# Altium project SO020100000.PrjPcb
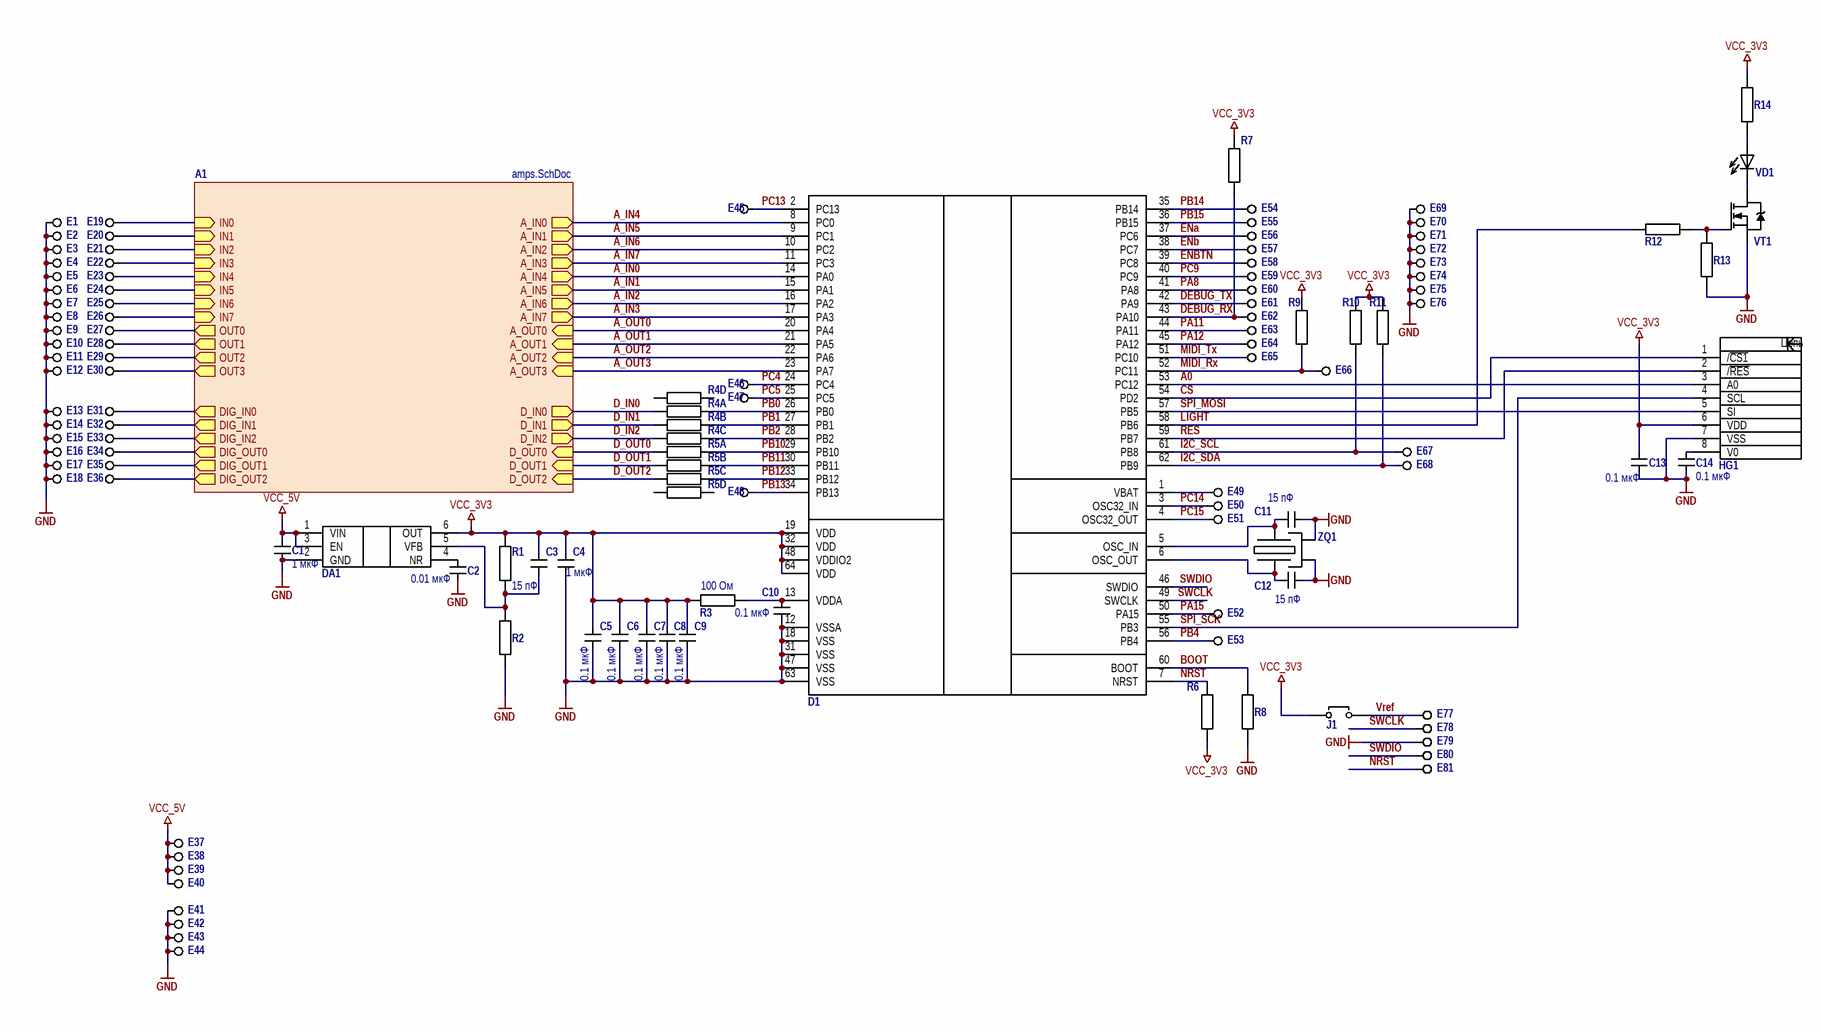
[diagram p0: main.SchDoc]
Revision: 0
2 sheets, 192 parts. Net scope: hierarchical (ports join the sheet entries above them; power ports are global).
Board file: SO020100001_001.PcbDoc
Sheets:
  main.SchDoc
    A1 = amps.SchDoc

## Sheet main.SchDoc
size 420 x 297 mm; DocumentNumber: 1; SheetNumber: 1; SheetTotal: 2

### Parts
C1  value 1 мкФ  [CAPC1608X08L]  (hidden comment: C0603_16v_1u)
C2  value 0.01 мкФ  [CAPC1608X08L]  (hidden comment: C0603_50v_0,01u)
C3  value 15 пФ  [CAPC1608X08L]  (hidden comment: C0603_50v_15p)
C4  value 1 мкФ  [CAPC1608X08L]  (hidden comment: C0603_16v_1u)
C5  value 0.1 мкФ  [CAPC1608X08L]  (hidden comment: C0603_50v_0,1u)
C6  value 0.1 мкФ  [CAPC1608X08L]  (hidden comment: C0603_50v_0,1u)
C7  value 0.1 мкФ  [CAPC1608X08L]  (hidden comment: C0603_50v_0,1u)
C8  value 0.1 мкФ  [CAPC1608X08L]  (hidden comment: C0603_50v_0,1u)
C9  value 0.1 мкФ  [CAPC1608X08L]  (hidden comment: C0603_50v_0,1u)
C10  value 0.1 мкФ  [CAPC1608X08L]  (hidden comment: C0603_50v_0,1u)
C11  value 15 пФ  [CAPC1608X08L]  (hidden comment: C0603_50v_15p)
C12  value 15 пФ  [CAPC1608X08L]  (hidden comment: C0603_50v_15p)
C13  value 0.1 мкФ  [CAPC1608X08L]  (hidden comment: C0603_50v_0,1u)
C14  value 0.1 мкФ  [CAPC1608X08L]  (hidden comment: C0603_50v_0,1u)
D1  STM32F091RB6  [TSQFP50P_10x10_64N]  (value not drawn)
DA1  TPS73001DBVT  [SOT95P280X145-6N]  (value not drawn)
E1  CON 0.9mm  [con_0.9mm]  (value not drawn)  (no BOM)
E2  CON 0.9mm  [con_0.9mm]  (value not drawn)  (no BOM)
E3  CON 0.9mm  [con_0.9mm]  (value not drawn)  (no BOM)
E4  CON 0.9mm  [con_0.9mm]  (value not drawn)  (no BOM)
E5  CON 0.9mm  [con_0.9mm]  (value not drawn)  (no BOM)
E6  CON 0.9mm  [con_0.9mm]  (value not drawn)  (no BOM)
E7  CON 0.9mm  [con_0.9mm]  (value not drawn)  (no BOM)
E8  CON 0.9mm  [con_0.9mm]  (value not drawn)  (no BOM)
E9  CON 0.9mm  [con_0.9mm]  (value not drawn)  (no BOM)
E10  CON 0.9mm  [con_0.9mm]  (value not drawn)  (no BOM)
E11  CON 0.9mm  [con_0.9mm]  (value not drawn)  (no BOM)
E12  CON 0.9mm  [con_0.9mm]  (value not drawn)  (no BOM)
E13  CON 0.9mm  [con_0.9mm]  (value not drawn)  (no BOM)
E14  CON 0.9mm  [con_0.9mm]  (value not drawn)  (no BOM)
E15  CON 0.9mm  [con_0.9mm]  (value not drawn)  (no BOM)
E16  CON 0.9mm  [con_0.9mm]  (value not drawn)  (no BOM)
E17  CON 0.9mm  [con_0.9mm]  (value not drawn)  (no BOM)
E18  CON 0.9mm  [con_0.9mm]  (value not drawn)  (no BOM)
E19  CON 0.9mm  [con_0.9mm]  (value not drawn)  (no BOM)
E20  CON 0.9mm  [con_0.9mm]  (value not drawn)  (no BOM)
E21  CON 0.9mm  [con_0.9mm]  (value not drawn)  (no BOM)
E22  CON 0.9mm  [con_0.9mm]  (value not drawn)  (no BOM)
E23  CON 0.9mm  [con_0.9mm]  (value not drawn)  (no BOM)
E24  CON 0.9mm  [con_0.9mm]  (value not drawn)  (no BOM)
E25  CON 0.9mm  [con_0.9mm]  (value not drawn)  (no BOM)
E26  CON 0.9mm  [con_0.9mm]  (value not drawn)  (no BOM)
E27  CON 0.9mm  [con_0.9mm]  (value not drawn)  (no BOM)
E28  CON 0.9mm  [con_0.9mm]  (value not drawn)  (no BOM)
E29  CON 0.9mm  [con_0.9mm]  (value not drawn)  (no BOM)
E30  CON 0.9mm  [con_0.9mm]  (value not drawn)  (no BOM)
E31  CON 0.9mm  [con_0.9mm]  (value not drawn)  (no BOM)
E32  CON 0.9mm  [con_0.9mm]  (value not drawn)  (no BOM)
E33  CON 0.9mm  [con_0.9mm]  (value not drawn)  (no BOM)
E34  CON 0.9mm  [con_0.9mm]  (value not drawn)  (no BOM)
E35  CON 0.9mm  [con_0.9mm]  (value not drawn)  (no BOM)
E36  CON 0.9mm  [con_0.9mm]  (value not drawn)  (no BOM)
E37  CON 0.9mm  [con_0.9mm]  (value not drawn)  (no BOM)
E38  CON 0.9mm  [con_0.9mm]  (value not drawn)  (no BOM)
E39  CON 0.9mm  [con_0.9mm]  (value not drawn)  (no BOM)
E40  CON 0.9mm  [con_0.9mm]  (value not drawn)  (no BOM)
E41  CON 0.9mm  [con_0.9mm]  (value not drawn)  (no BOM)
E42  CON 0.9mm  [con_0.9mm]  (value not drawn)  (no BOM)
E43  CON 0.9mm  [con_0.9mm]  (value not drawn)  (no BOM)
E44  CON 0.9mm  [con_0.9mm]  (value not drawn)  (no BOM)
E45  CON 0.9mm  [con_0.9mm]  (value not drawn)  (no BOM)
E46  CON 0.9mm  [con_0.9mm]  (value not drawn)  (no BOM)
E47  CON 0.9mm  [con_0.9mm]  (value not drawn)  (no BOM)
E48  CON 0.9mm  [con_0.9mm]  (value not drawn)  (no BOM)
E49  CON 0.9mm  [con_0.9mm]  (value not drawn)  (no BOM)
E50  CON 0.9mm  [con_0.9mm]  (value not drawn)  (no BOM)
E51  CON 0.9mm  [con_0.9mm]  (value not drawn)  (no BOM)
E52  CON 0.9mm  [con_0.9mm]  (value not drawn)  (no BOM)
E53  CON 0.9mm  [con_0.9mm]  (value not drawn)  (no BOM)
E54  CON 0.9mm  [con_0.9mm]  (value not drawn)  (no BOM)
E55  CON 0.9mm  [con_0.9mm]  (value not drawn)  (no BOM)
E56  CON 0.9mm  [con_0.9mm]  (value not drawn)  (no BOM)
E57  CON 0.9mm  [con_0.9mm]  (value not drawn)  (no BOM)
E58  CON 0.9mm  [con_0.9mm]  (value not drawn)  (no BOM)
E59  CON 0.9mm  [con_0.9mm]  (value not drawn)  (no BOM)
E60  CON 0.9mm  [con_0.9mm]  (value not drawn)  (no BOM)
E61  CON 0.9mm  [con_0.9mm]  (value not drawn)  (no BOM)
E62  CON 0.9mm  [con_0.9mm]  (value not drawn)  (no BOM)
E63  CON 0.9mm  [con_0.9mm]  (value not drawn)  (no BOM)
E64  CON 0.9mm  [con_0.9mm]  (value not drawn)  (no BOM)
E65  CON 0.9mm  [con_0.9mm]  (value not drawn)  (no BOM)
E66  CON 0.9mm  [con_0.9mm]  (value not drawn)  (no BOM)
E67  CON 0.9mm  [con_0.9mm]  (value not drawn)  (no BOM)
E68  CON 0.9mm  [con_0.9mm]  (value not drawn)  (no BOM)
E69  CON 0.9mm  [con_0.9mm]  (value not drawn)  (no BOM)
E70  CON 0.9mm  [con_0.9mm]  (value not drawn)  (no BOM)
E71  CON 0.9mm  [con_0.9mm]  (value not drawn)  (no BOM)
E72  CON 0.9mm  [con_0.9mm]  (value not drawn)  (no BOM)
E73  CON 0.9mm  [con_0.9mm]  (value not drawn)  (no BOM)
E74  CON 0.9mm  [con_0.9mm]  (value not drawn)  (no BOM)
E75  CON 0.9mm  [con_0.9mm]  (value not drawn)  (no BOM)
E76  CON 0.9mm  [con_0.9mm]  (value not drawn)  (no BOM)
E77  CON 0.9mm  [con_0.9mm]  (value not drawn)  (no BOM)
E78  CON 0.9mm  [con_0.9mm]  (value not drawn)  (no BOM)
E79  CON 0.9mm  [con_0.9mm]  (value not drawn)  (no BOM)
E80  CON 0.9mm  [con_0.9mm]  (value not drawn)  (no BOM)
E81  CON 0.9mm  [con_0.9mm]  (value not drawn)  (no BOM)
HG1  MT-12864  [MT-12864]  (value not drawn)
J1  Jumper_1x1  [jumper 1x1]  (value not drawn)  (no BOM)
R1  RES0603_51k  [RESC1608X04N]  (value not drawn)
R2  RES0603_30k±1%  [RESC1608X04N]  (value not drawn)
R3  value 100 Ом  [RESC1608X04N]  (hidden comment: RES0603_100r)
R4  CAT16-470J4  [CAC-80P320X160-8N]  (value not drawn)  (parts A,B,C,D of 4)
R5  CAT16-470J4  [CAC-80P320X160-8N]  (value not drawn)  (parts A,B,C,D of 4)
R6  RES0603_10k  [RESC1608X04N]  (value not drawn)
R7  RES0603_10k  [RESC1608X04N]  (value not drawn)
R8  RES0603_10k  [RESC1608X04N]  (value not drawn)
R9  RES0603_10k  [RESC1608X04N]  (value not drawn)
R10  RES0603_10k  [RESC1608X04N]  (value not drawn)
R11  RES0603_10k  [RESC1608X04N]  (value not drawn)
R12  RES0603_47R  [RESC1608X04N]  (value not drawn)
R13  RES0603_10k  [RESC1608X04N]  (value not drawn)
R14  RES0603_47R  [RESC1608X04N]  (value not drawn)
VD1  S11-161A-5W  [S11-161A-5W]  (value not drawn)
VT1  IRLML2402  [SOT95P245X110-3N]  (value not drawn)
ZQ1  TX3 12.0000 MHZ  [CDFN/DFN]  (value not drawn)

### Sub-sheets
A1 = amps.SchDoc: A_IN0 (out), A_IN1 (out), A_IN2 (out), A_IN3 (out), IN0 (in), IN1 (in), IN2 (in), IN3 (in), A_IN4 (out), IN4 (in), A_IN5 (out), IN5 (in), A_IN6 (out), IN6 (in), A_IN7 (out), IN7 (in), A_OUT0 (in), OUT0 (out), A_OUT1 (in), OUT1 (out), A_OUT2 (in), OUT2 (out), A_OUT3 (in), OUT3 (out), DIG_IN0 (out), D_IN0 (out), DIG_IN1 (out), D_IN1 (out), DIG_IN2 (out), D_IN2 (out), DIG_OUT2 (out), D_OUT2 (in), DIG_OUT1 (out), D_OUT1 (in), DIG_OUT0 (out), D_OUT0 (in)

### Nets
GND: C1.1 C2.1 C4.1 C5.1 C6.1 C7.1 C8.1 C9.1 C10.1 C11.2 C12.2 C13.1 C14.1 D1.12(VSSA) D1.18(VSS) D1.31(VSS) D1.47(VSS) D1.63(VSS) DA1.2(GND) E1.1 E2.1 E3.1 E4.1 E5.1 E6.1 E7.1 E8.1 E9.1 E10.1 E11.1 E12.1 E13.1 E14.1 E15.1 E16.1 E17.1 E18.1 E41.1 E42.1 E43.1 E44.1 E69.1 E70.1 E71.1 E72.1 E73.1 E74.1 E75.1 E76.1 E79.1 HG1.7(VSS) R2.1 R8.1 R13.1 VT1.2(Source) ZQ1.2 ZQ1.4
VCC_3V3: C3.2 C4.2 C5.2 C6.2 C7.2 C8.2 C9.2 C13.2 D1.19(VDD) D1.32(VDD) D1.48(VDDIO2) D1.64(VDD) DA1.6(OUT) HG1.6(VDD) J1.1 R1.2 R3.1 R6.1 R7.2 R9.2 R10.2 R11.2 R14.2
VCC_5V: C1.2 DA1.1(VIN) DA1.3(EN) E37.1 E38.1 E39.1 E40.1
A0: D1.53(PC12) HG1.3(A0)
A_IN0: D1.14(PA0) ; sheet A1/A_IN4
A_IN1: D1.15(PA1) ; sheet A1/A_IN5
A_IN2: D1.16(PA2) ; sheet A1/A_IN6
A_IN3: D1.17(PA3) ; sheet A1/A_IN7
A_IN4: D1.8(PC0) ; sheet A1/A_IN0
A_IN5: D1.9(PC1) ; sheet A1/A_IN1
A_IN6: D1.10(PC2) ; sheet A1/A_IN2
A_IN7: D1.11(PC3) ; sheet A1/A_IN3
A_OUT0: D1.20(PA4) ; sheet A1/A_OUT0
A_OUT1: D1.21(PA5) ; sheet A1/A_OUT1
A_OUT2: D1.22(PA6) ; sheet A1/A_OUT2
A_OUT3: D1.23(PA7) ; sheet A1/A_OUT3
BOOT: D1.60(BOOT) R8.2
~{CS}: D1.54(PD2) HG1.1(/~{CS1})
D_IN0: R4.1 ; sheet A1/D_IN0
D_IN1: R4.2 ; sheet A1/D_IN1
D_IN2: R4.3 ; sheet A1/D_IN2
D_OUT0: R5.1 ; sheet A1/D_OUT0
D_OUT1: R5.2 ; sheet A1/D_OUT1
D_OUT2: R5.3 ; sheet A1/D_OUT2
DEBUG_RX: D1.43(PA10) E62.1 R7.1
DEBUG_TX: D1.42(PA9) E61.1
ENa: D1.37(PC6) E56.1
ENb: D1.38(PC7) E57.1
ENBTN: D1.39(PC8) E58.1
I2C_SCL: D1.61(PB8) E67.1 R10.1
I2C_SDA: D1.62(PB9) E68.1 R11.1
LIGHT: D1.58(PB6) R12.2
MIDI_Rx: D1.52(PC11) E66.1 R9.1
MIDI_Tx: D1.51(PC10) E65.1
NRST: D1.7(NRST) E81.1 R6.2
PA8: D1.41(PA8) E60.1
PA11: D1.44(PA11) E63.1
PA12: D1.45(PA12) E64.1
PA15: D1.50(PA15) E52.1
PB0: D1.26(PB0) R4.8
PB1: D1.27(PB1) R4.7
PB2: D1.28(PB2) R4.6
PB4: D1.56(PB4) E53.1
PB10: D1.29(PB10) R5.8
PB11: D1.30(PB11) R5.7
PB12: D1.33(PB12) R5.6
PB13: D1.34(PB13) E48.1
PB14: D1.35(PB14) E54.1
PB15: D1.36(PB15) E55.1
PC9: D1.40(PC9) E59.1
PC13: D1.2(PC13) E45.1
PC14: D1.3(OSC32_IN) E50.1
PC15: D1.4(OSC32_OUT) E51.1
PС4: D1.24(PC4) E46.1
PС5: D1.25(PC5) E47.1
~{RES}: D1.59(PB7) HG1.2(/~{RES})
SPI_MOSI: D1.57(PB5) HG1.5(SI)
SPI_SCK: D1.55(PB3) HG1.4(SCL)
SWCLK: D1.49(SWCLK) E78.1
SWDIO: D1.46(SWDIO) E80.1
Vref: E77.1 J1.2
NetC2_2: C2.2 DA1.4(NR)
NetC3_1: C3.1 DA1.5(VFB) R1.1 R2.2
NetC10_2: C10.2 D1.13(VDDA) R3.2
NetC11_1: C11.1 D1.5(OSC_IN) ZQ1.3
NetC12_1: C12.1 D1.6(OSC_OUT) ZQ1.1
NetC14_2: C14.2 HG1.8(V0)
NetD1_1: D1.1(VBAT) E49.1
NetD2_3: E27.1 ; sheet A1/OUT0
NetD3_3: E28.1 ; sheet A1/OUT1
NetD4_1: E19.1 ; sheet A1/IN0
NetD5_1: E20.1 ; sheet A1/IN1
NetD6_1: E21.1 ; sheet A1/IN2
NetD7_1: E22.1 ; sheet A1/IN3
NetD8_3: E29.1 ; sheet A1/OUT2
NetD9_3: E30.1 ; sheet A1/OUT3
NetD10_1: E23.1 ; sheet A1/IN4
NetD11_1: E24.1 ; sheet A1/IN5
NetD12_1: E25.1 ; sheet A1/IN6
NetD13_1: E26.1 ; sheet A1/IN7
NetE31_1: E31.1 ; sheet A1/DIG_IN0
NetE32_1: E32.1 ; sheet A1/DIG_IN1
NetE33_1: E33.1 ; sheet A1/DIG_IN2
NetE34_1: E34.1 ; sheet A1/DIG_OUT0
NetE35_1: E35.1 ; sheet A1/DIG_OUT1
NetE36_1: E36.1 ; sheet A1/DIG_OUT2
NetR12_1: R12.1 R13.2 VT1.1(Gate)
NetR14_1: R14.1 VD1.2(A)
NetVD1_1: VD1.1(K) VT1.3(Drain)

Not connected (* = marked no-connect by the designer): R4 4 5; R5 4 5

### Notes on the sheet
- Версия
- Перв. примен.
- Справ. №
- Подп. дата
- Инв. № дубл.
- Взам. инв. №
- Подп. и дата
- Изм.
- Разраб.
- Лист
- № докум.
- Подп.
- Дата
- Лит.
- Масса
- Масштаб
- Пров.
- Т.контр.
- Листов
- Инв. № подл.
- Н.контр.
- Утв.
- ALTIUM GOSTBOM2.0 KEV
- Файл:
- Копировал
- Формат А3
- (in symbol CMP-00308-1) Цепь

### Library data of the parts
C1 C4 = CMP-001-00002-10: Чип 0603 16в 1мкФ; Bom_name: ЧИП-0603-X7R-16 В-1 мкФ ±10%; dopusk: ±10%; d_type: X7R; planar: 1; temp_range: -55...+155; PlaceALL_name: 0603-X7R-1u; PlaceALL_value: 1u; Type: 0603; napr: 16 В
C2 = CMP-00023-7: Чип 0603 50в 0,01мкФ; Bom_name: ЧИП-0603-X7R-50 В-0.01 мкФ ±10%; dopusk: ±10%; d_type: X7R; planar: 1; temp_range: -55...+155; PlaceALL_name: 0603-X7R-0.01u; PlaceALL_value: 0.01u; Type: 0603; napr: 50 В
C3 C11 C12 = CMP-00114-2: Чип 0603 50в 15 пФ; Bom_name: ЧИП-0603-NP0-50 В-15 пФ ±5%; dopusk: ±5%; d_type: NP0; PlaceALL_name: 0603-NP0-15p; PlaceALL_value: 15p; planar: 1; temp_range: -55...+155; Type: 0603; napr: 50 В
C5-C10 C13 C14 = CMP-001-00000-11: Чип 0603 50в 0,1мкФ; Bom_name: ЧИП-0603-X7R-50 В-0.1 мкФ ±10%; dopusk: ±10%; d_type: X7R; planar: 1; temp_range: -55...+155; PlaceALL_name: 0603-X7R-0.1u; PlaceALL_value: 0.1u; Type: 0603; napr: 50 В
D1 = CMP-020-00004-4: ARM®-based 32-bit MCU, up to 256 KB Flash; planar: 1; temp_range: -40…+150; Bom_name: STM32F091RB6; PlaceALL_name: =Name
DA1 = TPS73001: TPS730 Low-Noise, High PSRR, RF, 200-mA Low-Dropout Linear Regulators; name: TPS73001DBVT; type: Микросхемы
E1-E81 = CMP-00028-00014-2: Контакт 0,9мм
HG1 = CMP-00308-1: LCD индикатор MT-12864; planar: 1; temp_range: -20…+70; Bom_name: MT-12864; PlaceALL_name: =Name
J1 = CMP-00028-00000-7: Перемычка под пайку 1мм
R1 = CMP-00183-1: Чип 0603 51 кОм; Bom_name: ЧИП-0603 -51 кОм ±5%; dopusk: ±5%; PlaceALL_name: 0603-51k; PlaceALL_value: 51k; planar: 1; temp_range: -55...+155; value: 51 кОм; Type: 0603
R2 = CMP-00131-1: Чип 0603 30 кОм; Bom_name: ЧИП-0603 -30 кОм ±1%; dopusk: ±1%; PlaceALL_name: 0603-30k ±1%; PlaceALL_value: 30k; planar: 1; temp_range: -55...+155; value: 30 кОм; PlaceALL_dopusk: ±1%; Type: 0603
R3 = CMP-00024-9: Чип 0603 100 Ом; Bom_name: ЧИП-0603 -100 Ом ±5%; dopusk: ±5%; planar: 1; temp_range: -55...+155; PlaceALL_name: 0603-100r; PlaceALL_value: 100r; Type: 0603
R4 R5 = CMP-00001-8: Сборка 47 Ом; value: 47 Ом; dopusk: ±5%; planar: 1; temp_range: -55...+155; Bom_name: CAT16-470J4; PlaceALL_name: CAT16-470J4
R6-R11 R13 = CMP-00004-13: Чип 0603 10 кОм; Bom_name: ЧИП-0603 -10 кОм ±5%; dopusk: ±5%; planar: 1; value: 10 кОм; temp_range: -55...+155; PlaceALL_name: 0603-10k; PlaceALL_value: 10k; Type: 0603
R12 R14 = CMP-00003-13: Чип 0603 47 Ом; Bom_name: ЧИП-0603 -47 Ом ±5%; dopusk: ±5%; planar: 1; value: 47 Ом; temp_range: -55...+155; PlaceALL_name: 0603-47r; PlaceALL_value: 47r; Type: 0603
VD1 = CMP-00309-2: Светодиод зелёный 5mm; Bom_name: Светодиод S11-161A-5W; planar: 1; temp_range: -65...+175; PlaceALL_name: =Name
VT1 = CMP-00035-2: sot-23 HEXFET MOSFET; Bom_name: Транзистор IRLML2402TR; planar: 1; temp_range: -55…+150; PlaceALL_name: =Name
ZQ1 = CMP-003-00004-4: Кварцевый резонатор 12 МГц; Bom_name: Резонатор кварцевый TX3 12.0000 MHz; planar: 1; temp_range: -20…+70; PlaceALL_name: TX3 12.0000 MHZ

## Sheet amps.SchDoc
size 209 x 297 mm; SheetNumber: 2; SheetTotal: 2
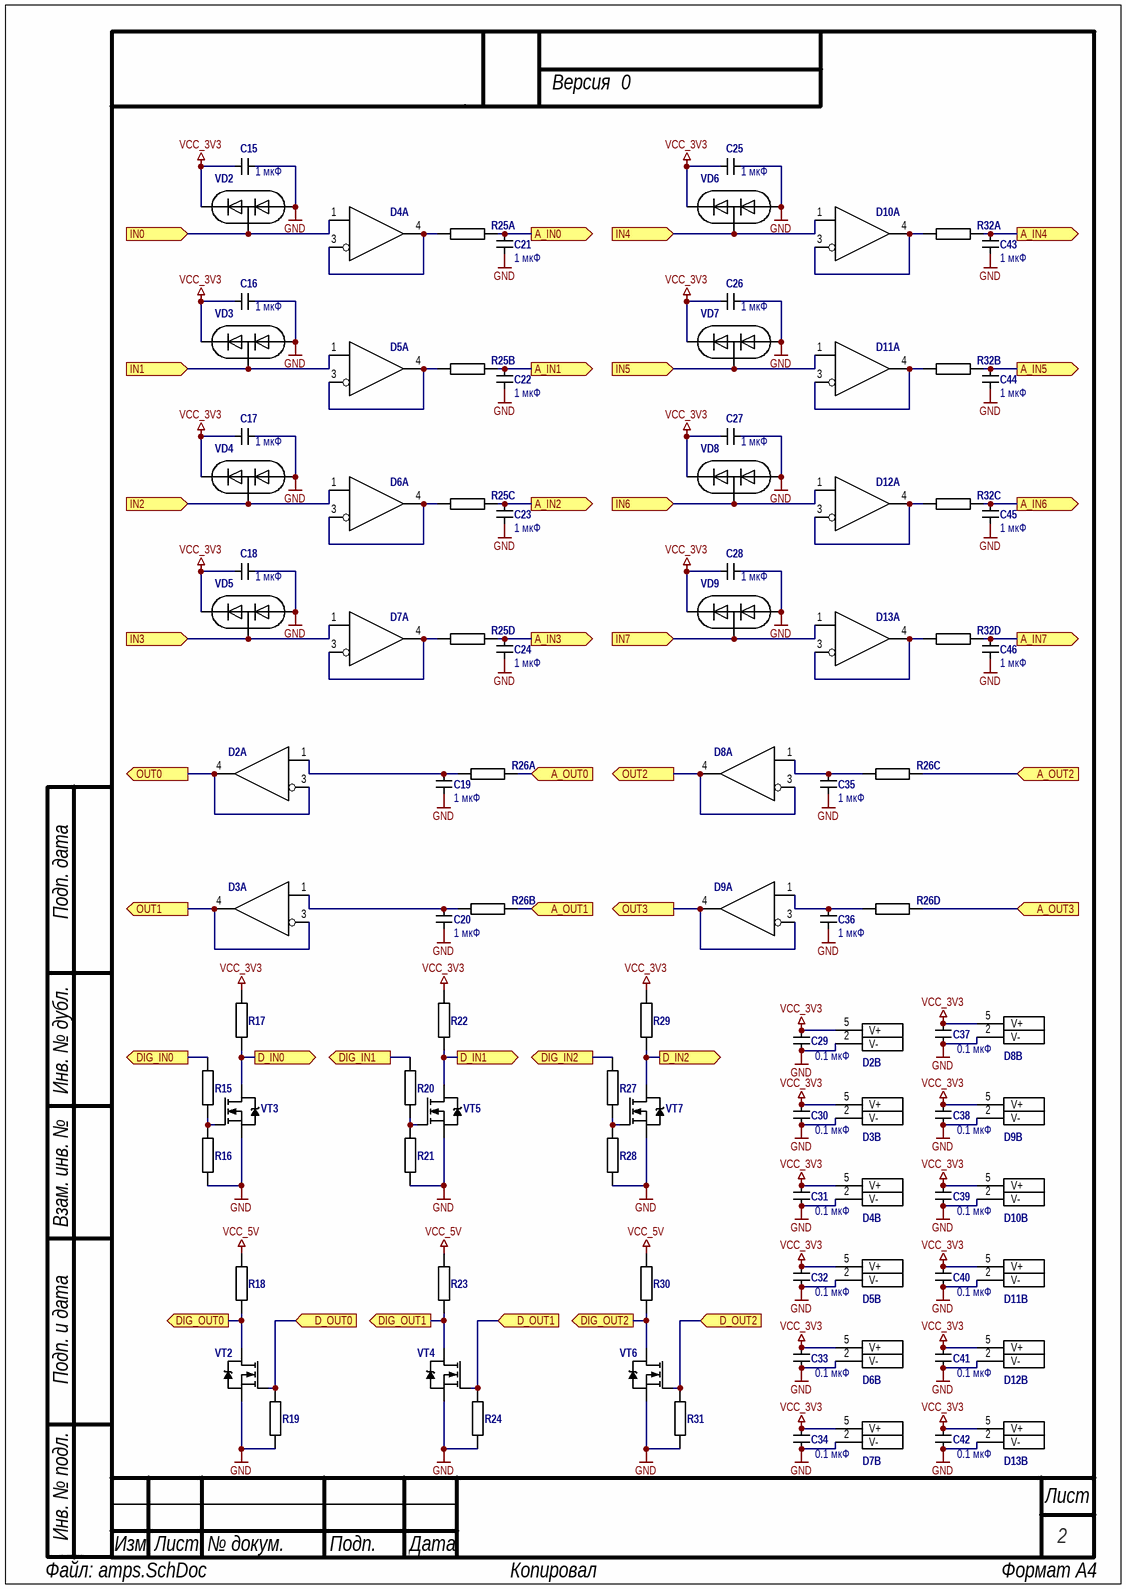
[diagram p1: amps.SchDoc]

### Parts
C15  value 1 мкФ  [CAPC1608X08L]  (hidden comment: C0603_16v_1u)
C16  value 1 мкФ  [CAPC1608X08L]  (hidden comment: C0603_16v_1u)
C17  value 1 мкФ  [CAPC1608X08L]  (hidden comment: C0603_16v_1u)
C18  value 1 мкФ  [CAPC1608X08L]  (hidden comment: C0603_16v_1u)
C19  value 1 мкФ  [CAPC1608X08L]  (hidden comment: C0603_16v_1u)
C20  value 1 мкФ  [CAPC1608X08L]  (hidden comment: C0603_16v_1u)
C21  value 1 мкФ  [CAPC1608X08L]  (hidden comment: C0603_16v_1u)
C22  value 1 мкФ  [CAPC1608X08L]  (hidden comment: C0603_16v_1u)
C23  value 1 мкФ  [CAPC1608X08L]  (hidden comment: C0603_16v_1u)
C24  value 1 мкФ  [CAPC1608X08L]  (hidden comment: C0603_16v_1u)
C25  value 1 мкФ  [CAPC1608X08L]  (hidden comment: C0603_16v_1u)
C26  value 1 мкФ  [CAPC1608X08L]  (hidden comment: C0603_16v_1u)
C27  value 1 мкФ  [CAPC1608X08L]  (hidden comment: C0603_16v_1u)
C28  value 1 мкФ  [CAPC1608X08L]  (hidden comment: C0603_16v_1u)
C29  value 0.1 мкФ  [CAPC1608X08L]  (hidden comment: C0603_50v_0,1u)
C30  value 0.1 мкФ  [CAPC1608X08L]  (hidden comment: C0603_50v_0,1u)
C31  value 0.1 мкФ  [CAPC1608X08L]  (hidden comment: C0603_50v_0,1u)
C32  value 0.1 мкФ  [CAPC1608X08L]  (hidden comment: C0603_50v_0,1u)
C33  value 0.1 мкФ  [CAPC1608X08L]  (hidden comment: C0603_50v_0,1u)
C34  value 0.1 мкФ  [CAPC1608X08L]  (hidden comment: C0603_50v_0,1u)
C35  value 1 мкФ  [CAPC1608X08L]  (hidden comment: C0603_16v_1u)
C36  value 1 мкФ  [CAPC1608X08L]  (hidden comment: C0603_16v_1u)
C37  value 0.1 мкФ  [CAPC1608X08L]  (hidden comment: C0603_50v_0,1u)
C38  value 0.1 мкФ  [CAPC1608X08L]  (hidden comment: C0603_50v_0,1u)
C39  value 0.1 мкФ  [CAPC1608X08L]  (hidden comment: C0603_50v_0,1u)
C40  value 0.1 мкФ  [CAPC1608X08L]  (hidden comment: C0603_50v_0,1u)
C41  value 0.1 мкФ  [CAPC1608X08L]  (hidden comment: C0603_50v_0,1u)
C42  value 0.1 мкФ  [CAPC1608X08L]  (hidden comment: C0603_50v_0,1u)
C43  value 1 мкФ  [CAPC1608X08L]  (hidden comment: C0603_16v_1u)
C44  value 1 мкФ  [CAPC1608X08L]  (hidden comment: C0603_16v_1u)
C45  value 1 мкФ  [CAPC1608X08L]  (hidden comment: C0603_16v_1u)
C46  value 1 мкФ  [CAPC1608X08L]  (hidden comment: C0603_16v_1u)
D2  AMP  [SOT23-5M]  (value not drawn)  (parts A,B of 2)
D3  AMP  [SOT23-5M]  (value not drawn)  (parts A,B of 2)
D4  AMP  [SOT23-5M]  (value not drawn)  (parts A,B of 2)
D5  AMP  [SOT23-5M]  (value not drawn)  (parts A,B of 2)
D6  AMP  [SOT23-5M]  (value not drawn)  (parts A,B of 2)
D7  AMP  [SOT23-5M]  (value not drawn)  (parts A,B of 2)
D8  AMP  [SOT23-5M]  (value not drawn)  (parts A,B of 2)
D9  AMP  [SOT23-5M]  (value not drawn)  (parts A,B of 2)
D10  AMP  [SOT23-5M]  (value not drawn)  (parts A,B of 2)
D11  AMP  [SOT23-5M]  (value not drawn)  (parts A,B of 2)
D12  AMP  [SOT23-5M]  (value not drawn)  (parts A,B of 2)
D13  AMP  [SOT23-5M]  (value not drawn)  (parts A,B of 2)
R15  RES0603_100r  [RESC1608X04N]  (value not drawn)
R16  RES0603_10k  [RESC1608X04N]  (value not drawn)
R17  RES0603_10k  [RESC1608X04N]  (value not drawn)
R18  RES0603_10k  [RESC1608X04N]  (value not drawn)
R19  RES0603_10k  [RESC1608X04N]  (value not drawn)
R20  RES0603_100r  [RESC1608X04N]  (value not drawn)
R21  RES0603_10k  [RESC1608X04N]  (value not drawn)
R22  RES0603_10k  [RESC1608X04N]  (value not drawn)
R23  RES0603_10k  [RESC1608X04N]  (value not drawn)
R24  RES0603_10k  [RESC1608X04N]  (value not drawn)
R25  CAT16-470J4  [CAC-80P320X160-8N]  (value not drawn)  (parts A,B,C,D of 4)
R26  CAT16-470J4  [CAC-80P320X160-8N]  (value not drawn)  (parts A,B,C,D of 4)
R27  RES0603_100r  [RESC1608X04N]  (value not drawn)
R28  RES0603_10k  [RESC1608X04N]  (value not drawn)
R29  RES0603_10k  [RESC1608X04N]  (value not drawn)
R30  RES0603_10k  [RESC1608X04N]  (value not drawn)
R31  RES0603_10k  [RESC1608X04N]  (value not drawn)
R32  CAT16-470J4  [CAC-80P320X160-8N]  (value not drawn)  (parts A,B,C,D of 4)
VD2  BAV199  [SOT95P245X110-3N]  (value not drawn)
VD3  BAV199  [SOT95P245X110-3N]  (value not drawn)
VD4  BAV199  [SOT95P245X110-3N]  (value not drawn)
VD5  BAV199  [SOT95P245X110-3N]  (value not drawn)
VD6  BAV199  [SOT95P245X110-3N]  (value not drawn)
VD7  BAV199  [SOT95P245X110-3N]  (value not drawn)
VD8  BAV199  [SOT95P245X110-3N]  (value not drawn)
VD9  BAV199  [SOT95P245X110-3N]  (value not drawn)
VT2  IRLML2402  [SOT95P245X110-3N]  (value not drawn)
VT3  IRLML2402  [SOT95P245X110-3N]  (value not drawn)
VT4  IRLML2402  [SOT95P245X110-3N]  (value not drawn)
VT5  IRLML2402  [SOT95P245X110-3N]  (value not drawn)
VT6  IRLML2402  [SOT95P245X110-3N]  (value not drawn)
VT7  IRLML2402  [SOT95P245X110-3N]  (value not drawn)

### Ports
A_IN0 (out, see main[2B]), A_IN1 (out, see main[2B]), A_IN2 (out, see main[2B]), A_IN3 (out, see main[2B]), A_IN4 (out, see main[2B]), A_IN5 (out, see main[2B]), A_IN6 (out, see main[2B]), A_IN7 (out, see main[2B]), A_OUT0 (in, see main[2B]), A_OUT1 (in, see main[2B]), A_OUT2 (in, see main[2B]), A_OUT3 (in, see main[2B]), D_IN0 (out, see main[2B]), D_IN1 (out, see main[2B]), D_IN2 (out, see main[2B]), D_OUT0 (in, see main[2B]), D_OUT1 (in, see main[2B]), D_OUT2 (in, see main[2B]), DIG_IN0 (out, see main[1B]), DIG_IN1 (out, see main[1B]), DIG_IN2 (out, see main[1B]), DIG_OUT0 (out, see main[1B]), DIG_OUT1 (out, see main[1B]), DIG_OUT2 (out, see main[1B]), IN0 (in, see main[1B]), IN1 (in, see main[1B]), IN2 (in, see main[1B]), IN3 (in, see main[1B]), IN4 (in, see main[1B]), IN5 (in, see main[1B]), IN6 (in, see main[1B]), IN7 (in, see main[1B]), OUT0 (out, see main[1B]), OUT1 (out, see main[1B]), OUT2 (out, see main[1B]), OUT3 (out, see main[1B])

### Nets
GND: C15.1 C16.1 C17.1 C18.1 C19.1 C20.1 C21.1 C22.1 C23.1 C24.1 C25.1 C26.1 C27.1 C28.1 C29.1 C30.1 C31.1 C32.1 C33.1 C34.1 C35.1 C36.1 C37.1 C38.1 C39.1 C40.1 C41.1 C42.1 C43.1 C44.1 C45.1 C46.1 D2.2(V-) D3.2(V-) D4.2(V-) D5.2(V-) D6.2(V-) D7.2(V-) D8.2(V-) D9.2(V-) D10.2(V-) D11.2(V-) D12.2(V-) D13.2(V-) R16.1 R19.1 R21.1 R24.1 R28.1 R31.1 VD2.1(A) VD3.1(A) VD4.1(A) VD5.1(A) VD6.1(A) VD7.1(A) VD8.1(A) VD9.1(A) VT2.2(Source) VT3.2(Source) VT4.2(Source) VT5.2(Source) VT6.2(Source) VT7.2(Source)
VCC_3V3: C15.2 C16.2 C17.2 C18.2 C25.2 C26.2 C27.2 C28.2 C29.2 C30.2 C31.2 C32.2 C33.2 C34.2 C37.2 C38.2 C39.2 C40.2 C41.2 C42.2 D2.5(V+) D3.5(V+) D4.5(V+) D5.5(V+) D6.5(V+) D7.5(V+) D8.5(V+) D9.5(V+) D10.5(V+) D11.5(V+) D12.5(V+) D13.5(V+) R17.2 R22.2 R29.2 VD2.2(K) VD3.2(K) VD4.2(K) VD5.2(K) VD6.2(K) VD7.2(K) VD8.2(K) VD9.2(K)
VCC_5V: R18.2 R23.2 R30.2
A_IN0: C43.2 R32.8 ; port A_IN4
A_IN1: C44.2 R32.7 ; port A_IN5
A_IN2: C45.2 R32.6 ; port A_IN6
A_IN3: C46.2 R32.5 ; port A_IN7
A_IN4: C21.2 R25.8 ; port A_IN0
A_IN5: C22.2 R25.7 ; port A_IN1
A_IN6: C23.2 R25.6 ; port A_IN2
A_IN7: C24.2 R25.5 ; port A_IN3
A_OUT0: R26.8 ; port A_OUT0
A_OUT1: R26.7 ; port A_OUT1
A_OUT2: R26.6 ; port A_OUT2
A_OUT3: R26.5 ; port A_OUT3
D_IN0: R17.1 VT3.3(Drain) ; port D_IN0
D_IN1: R22.1 VT5.3(Drain) ; port D_IN1
D_IN2: R29.1 VT7.3(Drain) ; port D_IN2
D_OUT0: R19.2 VT2.1(Gate) ; port D_OUT0
D_OUT1: R24.2 VT4.1(Gate) ; port D_OUT1
D_OUT2: R31.2 VT6.1(Gate) ; port D_OUT2
NetC19_2: C19.2 D2.1(+) R26.1
NetC20_2: C20.2 D3.1(+) R26.2
NetC35_2: C35.2 D8.1(+) R26.3
NetC36_2: C36.2 D9.1(+) R26.4
NetD2_3: D2.3(-) D2.4(OUT) ; port OUT0
NetD3_3: D3.3(-) D3.4(OUT) ; port OUT1
NetD4_1: D4.1(+) VD2.3(C) ; port IN0
NetD4_3: D4.3(-) D4.4(OUT) R25.1
NetD5_1: D5.1(+) VD3.3(C) ; port IN1
NetD5_3: D5.3(-) D5.4(OUT) R25.2
NetD6_1: D6.1(+) VD4.3(C) ; port IN2
NetD6_3: D6.3(-) D6.4(OUT) R25.3
NetD7_1: D7.1(+) VD5.3(C) ; port IN3
NetD7_3: D7.3(-) D7.4(OUT) R25.4
NetD8_3: D8.3(-) D8.4(OUT) ; port OUT2
NetD9_3: D9.3(-) D9.4(OUT) ; port OUT3
NetD10_1: D10.1(+) VD6.3(C) ; port IN4
NetD10_3: D10.3(-) D10.4(OUT) R32.1
NetD11_1: D11.1(+) VD7.3(C) ; port IN5
NetD11_3: D11.3(-) D11.4(OUT) R32.2
NetD12_1: D12.1(+) VD8.3(C) ; port IN6
NetD12_3: D12.3(-) D12.4(OUT) R32.3
NetD13_1: D13.1(+) VD9.3(C) ; port IN7
NetD13_3: D13.3(-) D13.4(OUT) R32.4
NetE31_1: R15.1 ; port DIG_IN0
NetE32_1: R20.1 ; port DIG_IN1
NetE33_1: R27.1 ; port DIG_IN2
NetE34_1: R18.1 VT2.3(Drain) ; port DIG_OUT0
NetE35_1: R23.1 VT4.3(Drain) ; port DIG_OUT1
NetE36_1: R30.1 VT6.3(Drain) ; port DIG_OUT2
NetR15_2: R15.2 R16.2 VT3.1(Gate)
NetR20_2: R20.2 R21.2 VT5.1(Gate)
NetR27_2: R27.2 R28.2 VT7.1(Gate)

### Notes on the sheet
- Версия
- Подп. дата
- Инв. № дубл.
- Взам. инв. №
- Подп. и дата
- Инв. № подл.
- Изм.
- Лист
- № докум.
- Подп.
- Дата
- Файл:
- ALTIUM GOSTBOM2.0 KEV
- Копировал
- Формат А4

### Library data of the parts
C15-C28 C35 C36 C43-C46 = CMP-001-00002-10: as C1 on sheet main; napr: 16 В
C29-C34 C37-C42 = CMP-001-00000-11: as C5 on sheet main; napr: 50 В
D2-D13 = LMV321IDBVR: ОУ; name: LMV321IDBVR
R15 R20 R27 = CMP-00024-9: Чип 0603 100 Ом; Bom_name: ЧИП-0603 -100 Ом ±5%; dopusk: ±5%; planar: 1; value: 100 Ом; temp_range: -55...+155; PlaceALL_name: 0603-100r; PlaceALL_value: 100r; Type: 0603
R16-R19 R21-R24 R28-R31 = CMP-00004-13: as R6 on sheet main; Type: 0603
R25 R26 R32 = CMP-00001-8: as R4 on sheet main; Bom_name: CAT16-470J4; PlaceALL_name: CAT16-470J4
VD2-VD9 = CMP-004-00001-6: Диодная сборка BAV199; Bom_name: Диод BAV199; planar: 1; temp_range: -40…+150; ComponentLink1URL: https://assets.nexperia.com/documents/data-sheet/BAV199.pdf; PlaceALL_name: BAV199
VT2-VT7 = CMP-00035-3: sot-23 HEXFET MOSFET; Bom_name: Транзистор IRLML2402TR; planar: 1; temp_range: -55…+150; PlaceALL_name: IRLML2402

## Nets that join several sheets
GND: main (57 pins), amps (64 pins)
VCC_3V3: main (23 pins), amps (43 pins)
VCC_5V: main (7 pins), amps (R18.2 R23.2 R30.2)
A_IN0: main (D1.14), amps (C43.2 R32.8)
A_IN1: main (D1.15), amps (C44.2 R32.7)
A_IN2: main (D1.16), amps (C45.2 R32.6)
A_IN3: main (D1.17), amps (C46.2 R32.5)
A_IN4: main (D1.8), amps (C21.2 R25.8)
A_IN5: main (D1.9), amps (C22.2 R25.7)
A_IN6: main (D1.10), amps (C23.2 R25.6)
A_IN7: main (D1.11), amps (C24.2 R25.5)
A_OUT0: main (D1.20), amps (R26.8)
A_OUT1: main (D1.21), amps (R26.7)
A_OUT2: main (D1.22), amps (R26.6)
A_OUT3: main (D1.23), amps (R26.5)
D_IN0: main (R4.1), amps (R17.1 VT3.3)
D_IN1: main (R4.2), amps (R22.1 VT5.3)
D_IN2: main (R4.3), amps (R29.1 VT7.3)
D_OUT0: main (R5.1), amps (R19.2 VT2.1)
D_OUT1: main (R5.2), amps (R24.2 VT4.1)
D_OUT2: main (R5.3), amps (R31.2 VT6.1)
NetD2_3: main (E27.1), amps (D2.3 D2.4)
NetD3_3: main (E28.1), amps (D3.3 D3.4)
NetD4_1: main (E19.1), amps (D4.1 VD2.3)
NetD5_1: main (E20.1), amps (D5.1 VD3.3)
NetD6_1: main (E21.1), amps (D6.1 VD4.3)
NetD7_1: main (E22.1), amps (D7.1 VD5.3)
NetD8_3: main (E29.1), amps (D8.3 D8.4)
NetD9_3: main (E30.1), amps (D9.3 D9.4)
NetD10_1: main (E23.1), amps (D10.1 VD6.3)
NetD11_1: main (E24.1), amps (D11.1 VD7.3)
NetD12_1: main (E25.1), amps (D12.1 VD8.3)
NetD13_1: main (E26.1), amps (D13.1 VD9.3)
NetE31_1: main (E31.1), amps (R15.1)
NetE32_1: main (E32.1), amps (R20.1)
NetE33_1: main (E33.1), amps (R27.1)
NetE34_1: main (E34.1), amps (R18.1 VT2.3)
NetE35_1: main (E35.1), amps (R23.1 VT4.3)
NetE36_1: main (E36.1), amps (R30.1 VT6.3)